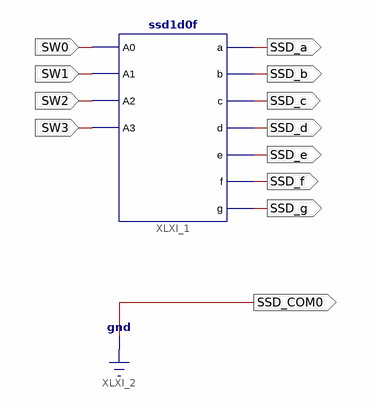
[diagram p0: schematic sheet 1]
// Xilinx ISE schematic main.sch (spartan6) as structural Verilog: 1 symbols, 12 ports
module main (
  input  SW0,
  input  SW1,
  input  SW2,
  input  SW3,
  output SSD_a,
  output SSD_b,
  output SSD_c,
  output SSD_d,
  output SSD_e,
  output SSD_f,
  output SSD_g,
  output SSD_COM0
);

  ssd1d0f XLXI_1 (
    .a(SSD_a), .A0(SW0), .A1(SW1), .A2(SW2), .A3(SW3), .b(SSD_b), .c(SSD_c), .d(SSD_d), .e(SSD_e), .f(SSD_f),
    .g(SSD_g));

  assign SSD_COM0 = 1'b0;
endmodule
